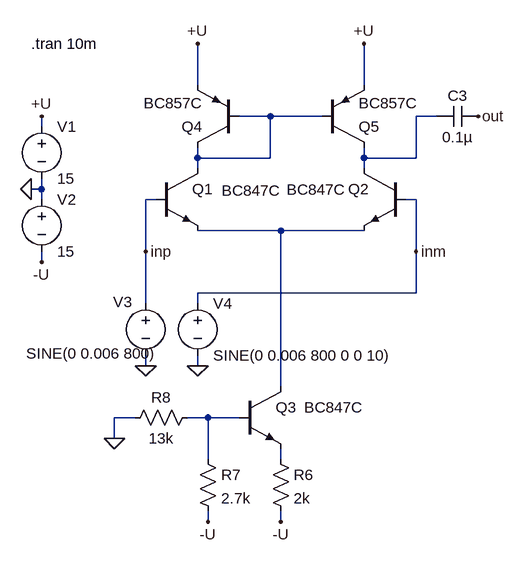
[diagram p0: schematic current-mirror.asc]
current-mirror.asc, the LTspice schematic file:
Version 4
SHEET 1 880 744
WIRE 288 0 288 -64
WIRE 544 0 544 -64
WIRE 400 48 352 48
WIRE 480 48 400 48
WIRE 656 48 624 48
WIRE 48 64 48 48
WIRE 288 112 288 96
WIRE 400 112 400 48
WIRE 400 112 288 112
WIRE 544 112 544 96
WIRE 624 112 624 48
WIRE 624 112 544 112
WIRE 288 128 288 112
WIRE 544 128 544 112
WIRE 48 160 48 144
WIRE 48 160 32 160
WIRE 48 176 48 160
WIRE 224 176 208 176
WIRE 624 176 608 176
WIRE 416 224 288 224
WIRE 544 224 416 224
WIRE 208 256 208 176
WIRE 624 256 624 176
WIRE 48 272 48 256
WIRE 624 320 624 256
WIRE 624 320 288 320
WIRE 208 336 208 256
WIRE 288 336 288 320
WIRE 208 432 208 416
WIRE 288 432 288 416
WIRE 416 464 416 224
WIRE 192 512 160 512
WIRE 304 512 272 512
WIRE 352 512 304 512
WIRE 160 544 160 512
WIRE 304 576 304 512
WIRE 416 576 416 560
WIRE 304 672 304 656
WIRE 416 672 416 656
FLAG 32 160 0
FLAG 48 48 +U
FLAG 48 272 -U
FLAG 288 -64 +U
FLAG 544 -64 +U
FLAG 720 48 out
FLAG 208 256 inp
FLAG 624 256 inm
FLAG 208 432 0
FLAG 288 432 0
FLAG 416 672 -U
FLAG 304 672 -U
FLAG 160 544 0
SYMBOL voltage 48 48 R0
WINDOW 123 0 0 Left 2
WINDOW 39 0 0 Left 2
SYMATTR InstName V1
SYMATTR Value 15
SYMBOL voltage 48 160 R0
WINDOW 123 0 0 Left 2
WINDOW 39 0 0 Left 2
SYMATTR InstName V2
SYMATTR Value 15
SYMBOL npn 224 128 R0
WINDOW 3 101 34 Left 2
SYMATTR Value BC847C
SYMATTR InstName Q1
SYMBOL npn 608 128 M0
WINDOW 3 92 33 Left 2
SYMATTR Value BC847C
SYMATTR InstName Q2
SYMBOL voltage 208 320 R0
WINDOW 0 -50 14 Left 2
WINDOW 3 -184 93 Left 2
WINDOW 123 0 0 Left 2
WINDOW 39 0 0 Left 2
SYMATTR InstName V3
SYMATTR Value SINE(0 0.006 800)
SYMBOL voltage 288 320 R0
WINDOW 123 0 0 Left 2
WINDOW 39 0 0 Left 2
SYMATTR InstName V4
SYMATTR Value SINE(0 0.006 800 0 0 10)
SYMBOL cap 720 32 R90
WINDOW 0 0 32 VBottom 2
WINDOW 3 32 32 VTop 2
SYMATTR InstName C3
SYMATTR Value 0.1µ
SYMBOL npn 352 464 R0
WINDOW 3 100 32 Left 2
SYMATTR Value BC847C
SYMATTR InstName Q3
SYMBOL res 400 560 R0
SYMATTR InstName R6
SYMATTR Value 2k
SYMBOL res 288 560 R0
SYMATTR InstName R7
SYMATTR Value 2.7k
SYMBOL res 288 496 R90
WINDOW 0 0 56 VBottom 2
WINDOW 3 32 56 VTop 2
SYMATTR InstName R8
SYMATTR Value 13k
SYMBOL pnp 352 96 R180
SYMATTR InstName Q4
SYMATTR Value BC857C
SYMBOL pnp 480 96 M180
SYMATTR InstName Q5
SYMATTR Value BC857C
TEXT 32 -64 Left 2 !.tran 10m

The netlist it stands for:
* current-mirror.asc
V1 +U 0 15
V2 0 -U 15
Q1 N001 inp N003 0 BC847C
Q2 N002 inm N003 0 BC847C
V3 inp 0 SINE(0 0.006 800)
V4 inm 0 SINE(0 0.006 800 0 0 10)
C3 out N002 0.1µ
Q3 N003 N004 N005 0 BC847C
R6 N005 -U 2k
R7 N004 -U 2.7k
R8 N004 0 13k
Q4 N001 N001 +U 0 BC857C
Q5 N002 N001 +U 0 BC857C
.model NPN NPN
.model PNP PNP
.lib standard.bjt
.tran 10m
.backanno
.end